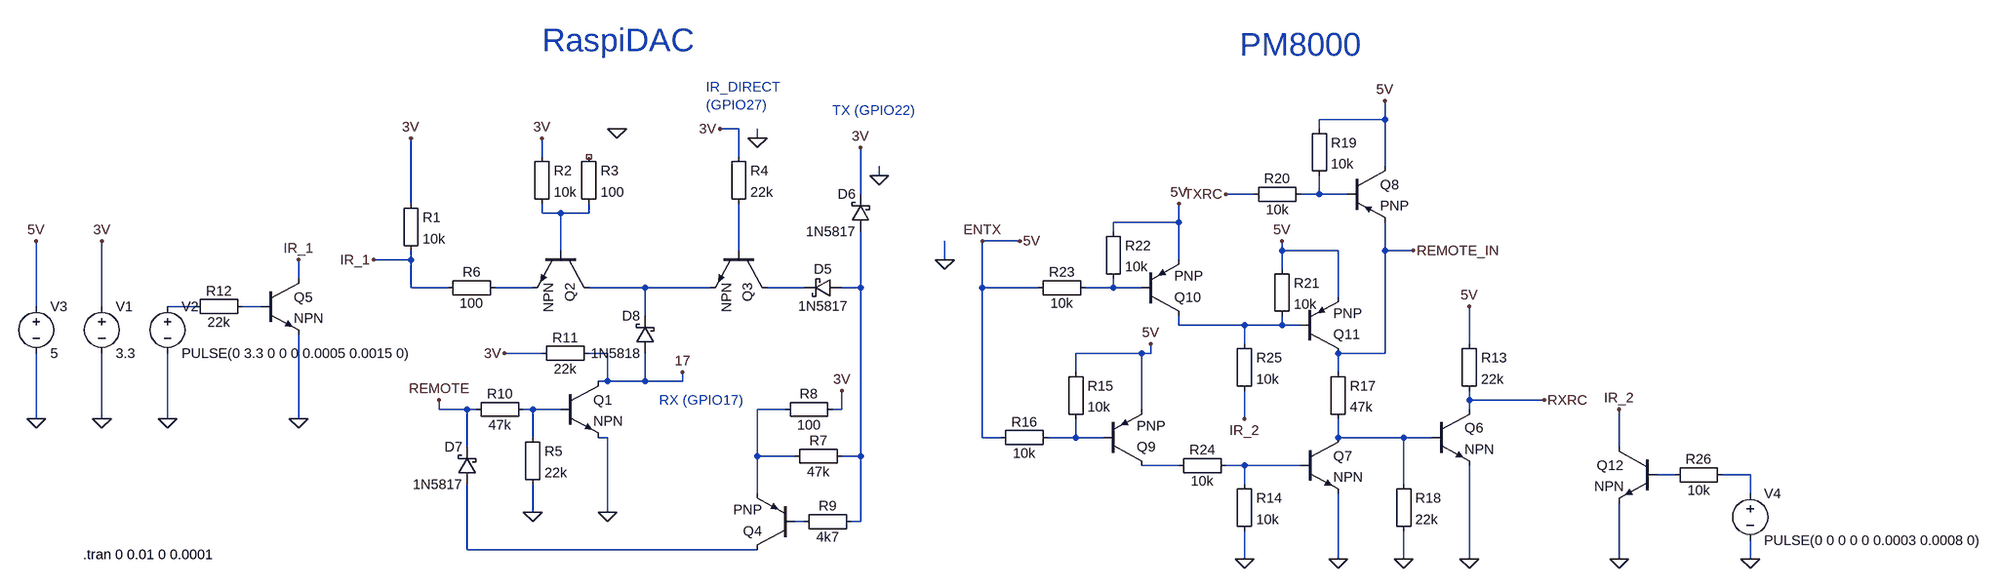
[diagram p0: schematic InfraRed.asc]
InfraRed.asc, the LTspice schematic file:
Version 4
SHEET 1 2592 680
WIRE 1520 -336 1520 -368
WIRE 1520 -336 1408 -336
WIRE 416 -320 384 -320
WIRE 1408 -320 1408 -336
WIRE 448 -304 448 -320
WIRE 80 -272 80 -304
WIRE 416 -272 416 -320
WIRE 1520 -256 1520 -336
WIRE 656 -240 656 -256
WIRE 624 -208 624 -288
WIRE 1296 -208 1248 -208
WIRE 1408 -208 1408 -240
WIRE 1408 -208 1376 -208
WIRE 1456 -208 1408 -208
WIRE -144 -192 -144 -304
WIRE 80 -176 80 -192
WIRE 112 -176 80 -176
WIRE 160 -176 160 -192
WIRE 160 -176 112 -176
WIRE 1168 -160 1168 -192
WIRE 1168 -160 1056 -160
WIRE 1056 -144 1056 -160
WIRE 896 -128 832 -128
WIRE 112 -112 112 -176
WIRE 416 -112 416 -192
WIRE 1344 -112 1344 -128
WIRE 1440 -112 1344 -112
WIRE 1520 -112 1520 -160
WIRE 1568 -112 1520 -112
WIRE -144 -96 -144 -112
WIRE -144 -96 -208 -96
WIRE 768 -96 768 -128
WIRE 1168 -96 1168 -160
WIRE 1344 -80 1344 -112
WIRE -336 -64 -336 -96
WIRE -144 -48 -144 -96
WIRE -80 -48 -144 -48
WIRE 64 -48 0 -48
WIRE 256 -48 160 -48
WIRE 368 -48 256 -48
WIRE 528 -48 464 -48
WIRE 624 -48 624 -144
WIRE 624 -48 592 -48
WIRE 832 -48 832 -128
WIRE 928 -48 832 -48
WIRE 1056 -48 1056 -64
WIRE 1056 -48 1008 -48
WIRE 1104 -48 1056 -48
WIRE 1440 -32 1440 -112
WIRE -784 -16 -784 -128
WIRE -672 -16 -672 -128
WIRE -512 -16 -560 -16
WIRE -400 -16 -432 -16
WIRE 256 0 256 -48
WIRE 1168 16 1168 0
WIRE 1280 16 1168 16
WIRE 1344 16 1344 0
WIRE 1344 16 1280 16
WIRE 1376 16 1344 16
WIRE 1280 48 1280 16
WIRE 1664 48 1664 -16
WIRE 80 64 16 64
WIRE 192 64 160 64
WIRE 1104 64 992 64
WIRE 1120 64 1120 48
WIRE 1120 64 1104 64
WIRE 1520 64 1520 -112
WIRE 1520 64 1440 64
WIRE 992 96 992 64
WIRE 1440 96 1440 64
WIRE 192 112 192 64
WIRE 192 112 176 112
WIRE 256 112 256 64
WIRE 256 112 192 112
WIRE 320 112 320 96
WIRE 320 112 256 112
WIRE 1664 144 1664 128
WIRE 1792 144 1664 144
WIRE -96 160 -96 144
WIRE -48 160 -96 160
WIRE -32 160 -48 160
WIRE 64 160 48 160
WIRE 112 160 64 160
WIRE 496 160 448 160
WIRE 592 160 592 128
WIRE 592 160 576 160
WIRE 1104 160 1104 64
WIRE 1664 160 1664 144
WIRE -784 176 -784 64
WIRE -672 176 -672 64
WIRE -560 176 -560 64
WIRE -336 176 -336 32
WIRE 1280 176 1280 128
WIRE 64 208 64 160
WIRE 192 208 176 208
WIRE 832 208 832 -48
WIRE 864 208 832 208
WIRE 992 208 992 176
WIRE 992 208 944 208
WIRE 1040 208 992 208
WIRE 1440 208 1440 176
WIRE 1552 208 1440 208
WIRE 1600 208 1552 208
WIRE -48 224 -48 160
WIRE 1920 224 1920 160
WIRE 448 240 448 160
WIRE 512 240 448 240
WIRE 624 240 624 -48
WIRE 624 240 592 240
WIRE 1168 256 1104 256
WIRE 1280 256 1248 256
WIRE 1376 256 1280 256
WIRE 2016 272 1984 272
WIRE 2144 272 2096 272
WIRE 1280 288 1280 256
WIRE 1552 288 1552 208
WIRE 448 304 448 240
WIRE 2144 304 2144 272
WIRE 64 336 64 288
WIRE 192 336 192 208
WIRE 528 352 512 352
WIRE 624 352 624 240
WIRE 624 352 608 352
WIRE -48 400 -48 288
WIRE 448 400 -48 400
WIRE 1280 416 1280 368
WIRE 1440 416 1440 304
WIRE 1552 416 1552 368
WIRE 1664 416 1664 256
WIRE 1920 416 1920 320
WIRE 2144 416 2144 384
FLAG 64 336 0
FLAG 192 336 0
FLAG 208 -320 0
FLAG -672 176 0
FLAG -672 -128 3V
FLAG -144 -304 3V
FLAG 80 -304 3V
FLAG 16 64 3V
FLAG 592 128 3V
FLAG 624 -288 3V
FLAG 384 -320 3V
FLAG 448 -304 0
FLAG 656 -240 0
FLAG -560 176 0
FLAG -336 176 0
FLAG 320 96 17
FLAG -208 -96 IR_1
FLAG -96 144 REMOTE
FLAG -784 176 0
FLAG -784 -128 5V
FLAG 1664 416 0
FLAG 1552 416 0
FLAG 1440 416 0
FLAG 1280 416 0
FLAG 1664 -16 5V
FLAG 1520 -368 5V
FLAG 1168 -192 5V
FLAG 1344 -128 5V
FLAG 1120 48 5V
FLAG 832 -128 ENTX
FLAG 1568 -112 REMOTE_IN
FLAG 1280 176 IR_2
FLAG 1920 160 IR_2
FLAG 1792 144 RXRC
FLAG 1248 -208 TXRC
FLAG 768 -96 0
FLAG 896 -128 5V
FLAG 2144 416 0
FLAG 1920 416 0
FLAG -336 -96 IR_1
SYMBOL npn 112 112 R0
SYMATTR InstName Q1
SYMBOL npn 160 -112 R90
SYMATTR InstName Q2
SYMBOL npn 464 -112 R90
SYMATTR InstName Q3
SYMBOL pnp 512 400 R180
SYMATTR InstName Q4
SYMBOL schottky 592 -64 R90
WINDOW 0 0 32 VBottom 2
WINDOW 3 32 32 VTop 2
SYMATTR InstName D5
SYMATTR Value 1N5817
SYMBOL schottky 640 -144 R180
WINDOW 0 24 64 Left 2
WINDOW 3 24 0 Left 2
SYMATTR InstName D6
SYMATTR Value 1N5817
SYMBOL schottky -32 288 R180
WINDOW 0 24 64 Left 2
WINDOW 3 24 0 Left 2
SYMATTR InstName D7
SYMATTR Value 1N5817
SYMBOL schottky 272 64 R180
WINDOW 0 24 64 Left 2
WINDOW 3 24 0 Left 2
SYMATTR InstName D8
SYMATTR Value 1N5818
SYMBOL Misc\\EuropeanResistor -160 -208 R0
SYMATTR InstName R1
SYMATTR Value 10k
SYMBOL Misc\\EuropeanResistor 64 -288 R0
SYMATTR InstName R2
SYMATTR Value 10k
SYMBOL Misc\\EuropeanResistor 144 -288 R0
SYMATTR InstName R3
SYMATTR Value 100
SYMBOL Misc\\EuropeanResistor 400 -288 R0
SYMATTR InstName R4
SYMATTR Value 22k
SYMBOL Misc\\EuropeanResistor 48 192 R0
SYMATTR InstName R5
SYMATTR Value 22k
SYMBOL Misc\\EuropeanResistor 16 -64 R90
WINDOW 0 5 56 VBottom 2
WINDOW 3 27 56 VTop 2
SYMATTR InstName R6
SYMATTR Value 100
SYMBOL Misc\\EuropeanResistor 608 224 R90
WINDOW 0 5 56 VBottom 2
WINDOW 3 27 56 VTop 2
SYMATTR InstName R7
SYMATTR Value 47k
SYMBOL Misc\\EuropeanResistor 592 144 R90
WINDOW 0 5 56 VBottom 2
WINDOW 3 27 56 VTop 2
SYMATTR InstName R8
SYMATTR Value 100
SYMBOL Misc\\EuropeanResistor 624 336 R90
WINDOW 0 5 56 VBottom 2
WINDOW 3 27 56 VTop 2
SYMATTR InstName R9
SYMATTR Value 4k7
SYMBOL Misc\\EuropeanResistor 64 144 R90
WINDOW 0 5 56 VBottom 2
WINDOW 3 27 56 VTop 2
SYMATTR InstName R10
SYMATTR Value 47k
SYMBOL voltage -672 -32 R0
WINDOW 123 0 0 Left 2
WINDOW 39 0 0 Left 2
SYMATTR InstName V1
SYMATTR Value 3.3
SYMBOL Misc\\EuropeanResistor 176 48 R90
WINDOW 0 5 56 VBottom 2
WINDOW 3 27 56 VTop 2
SYMATTR InstName R11
SYMATTR Value 22k
SYMBOL voltage -560 -32 R0
WINDOW 123 0 0 Left 2
WINDOW 39 0 0 Left 2
SYMATTR InstName V2
SYMATTR Value PULSE(0 3.3 0 0 0 0.0005 0.0015 0)
SYMBOL Misc\\EuropeanResistor -416 -32 R90
WINDOW 0 5 56 VBottom 2
WINDOW 3 27 56 VTop 2
SYMATTR InstName R12
SYMATTR Value 22k
SYMBOL npn -400 -64 R0
SYMATTR InstName Q5
SYMBOL voltage -784 -32 R0
WINDOW 123 0 0 Left 2
WINDOW 39 0 0 Left 2
SYMATTR InstName V3
SYMATTR Value 5
SYMBOL npn 1600 160 R0
SYMATTR InstName Q6
SYMBOL npn 1376 208 R0
SYMATTR InstName Q7
SYMBOL pnp 1456 -256 R0
SYMATTR InstName Q8
SYMBOL pnp 1040 256 M180
SYMATTR InstName Q9
SYMBOL pnp 1104 0 M180
SYMATTR InstName Q10
SYMBOL pnp 1376 64 M180
SYMATTR InstName Q11
SYMBOL Misc\\EuropeanResistor 1648 32 R0
SYMATTR InstName R13
SYMATTR Value 22k
SYMBOL Misc\\EuropeanResistor 1264 272 R0
SYMATTR InstName R14
SYMATTR Value 10k
SYMBOL Misc\\EuropeanResistor 976 80 R0
SYMATTR InstName R15
SYMATTR Value 10k
SYMBOL Misc\\EuropeanResistor 960 192 R90
WINDOW 0 5 56 VBottom 2
WINDOW 3 27 56 VTop 2
SYMATTR InstName R16
SYMATTR Value 10k
SYMBOL Misc\\EuropeanResistor 1424 80 R0
SYMATTR InstName R17
SYMATTR Value 47k
SYMBOL Misc\\EuropeanResistor 1536 272 R0
SYMATTR InstName R18
SYMATTR Value 22k
SYMBOL Misc\\EuropeanResistor 1392 -336 R0
SYMATTR InstName R19
SYMATTR Value 10k
SYMBOL Misc\\EuropeanResistor 1392 -224 R90
WINDOW 0 5 56 VBottom 2
WINDOW 3 27 56 VTop 2
SYMATTR InstName R20
SYMATTR Value 10k
SYMBOL Misc\\EuropeanResistor 1328 -96 R0
SYMATTR InstName R21
SYMATTR Value 10k
SYMBOL Misc\\EuropeanResistor 1040 -160 R0
SYMATTR InstName R22
SYMATTR Value 10k
SYMBOL Misc\\EuropeanResistor 1024 -64 R90
WINDOW 0 5 56 VBottom 2
WINDOW 3 27 56 VTop 2
SYMATTR InstName R23
SYMATTR Value 10k
SYMBOL Misc\\EuropeanResistor 1264 240 R90
WINDOW 0 5 56 VBottom 2
WINDOW 3 27 56 VTop 2
SYMATTR InstName R24
SYMATTR Value 10k
SYMBOL Misc\\EuropeanResistor 1264 32 R0
SYMATTR InstName R25
SYMATTR Value 10k
SYMBOL voltage 2144 288 R0
WINDOW 123 0 0 Left 2
WINDOW 39 0 0 Left 2
SYMATTR InstName V4
SYMATTR Value PULSE(0 0 0 0 0 0.0003 0.0008 0)
SYMBOL npn 1984 224 M0
SYMATTR InstName Q12
SYMBOL Misc\\EuropeanResistor 2112 256 R90
WINDOW 0 5 56 VBottom 2
WINDOW 3 27 56 VTop 2
SYMATTR InstName R26
SYMATTR Value 10k
TEXT -704 408 Left 2 !.tran 0 0.01 0 0.0001
TEXT 1272 -464 Left 5 ;PM8000
TEXT 80 -472 Left 5 ;RaspiDAC
TEXT 360 -392 Left 2 ;IR_DIRECT\n(GPIO27)
TEXT 576 -352 Left 2 ;TX (GPIO22)
TEXT 280 144 Left 2 ;RX (GPIO17)

The netlist it stands for:
* InfraRed.asc
Q1 17 N012 0 0 NPN
Q2 N005 N002 N004 0 NPN
Q3 N006 N003 N005 0 NPN
Q4 N021 N020 N013 0 PNP
D5 N007 N006 1N5817
D6 N007 3V 1N5817
D7 N021 REMOTE 1N5817
D8 17 N005 1N5818
R1 3V IR_1 10k
R2 3V N002 10k
R3 NC_01 N002 100
R4 3V N003 22k
R5 N012 0 22k
R6 N004 IR_1 100
R7 N007 N013 47k
R8 3V N013 100
R9 N007 N020 4k7
R10 N012 REMOTE 47k
V1 3V 0 3.3
R11 17 3V 22k
V2 N009 0 PULSE(0 3.3 0 0 0 0.0005 0.0015 0)
R12 N010 N009 22k
Q5 IR_1 N010 0 0 NPN
V3 ENTX 0 5
Q6 RXRC N015 0 0 NPN
Q7 N015 N017 0 0 NPN
Q8 ENTX N001 REMOTE_IN 0 PNP
Q9 N016 N014 ENTX 0 PNP
Q10 N011 N008 ENTX 0 PNP
Q11 REMOTE_IN N011 ENTX 0 PNP
R13 ENTX RXRC 22k
R14 N017 0 10k
R15 ENTX N014 10k
R16 N014 ENTX 10k
R17 REMOTE_IN N015 47k
R18 N015 0 22k
R19 ENTX N001 10k
R20 N001 TXRC 10k
R21 ENTX N011 10k
R22 ENTX N008 10k
R23 N008 ENTX 10k
R24 N017 N016 10k
R25 N011 IR_2 10k
V4 N019 0 PULSE(0 0 0 0 0 0.0003 0.0008 0)
Q12 IR_2 N018 0 0 NPN
R26 N019 N018 10k
.model D D
.lib standard.dio
.model NPN NPN
.model PNP PNP
.lib standard.bjt
.tran 0 0.01 0 0.0001
* PM8000
* RaspiDAC
* IR_DIRECT
* (GPIO27)
* TX (GPIO22)
* RX (GPIO17)
.backanno
.end